# EAGLE design binary_watch (EAGLE 9.6.2)

## Sheet 1 of 2
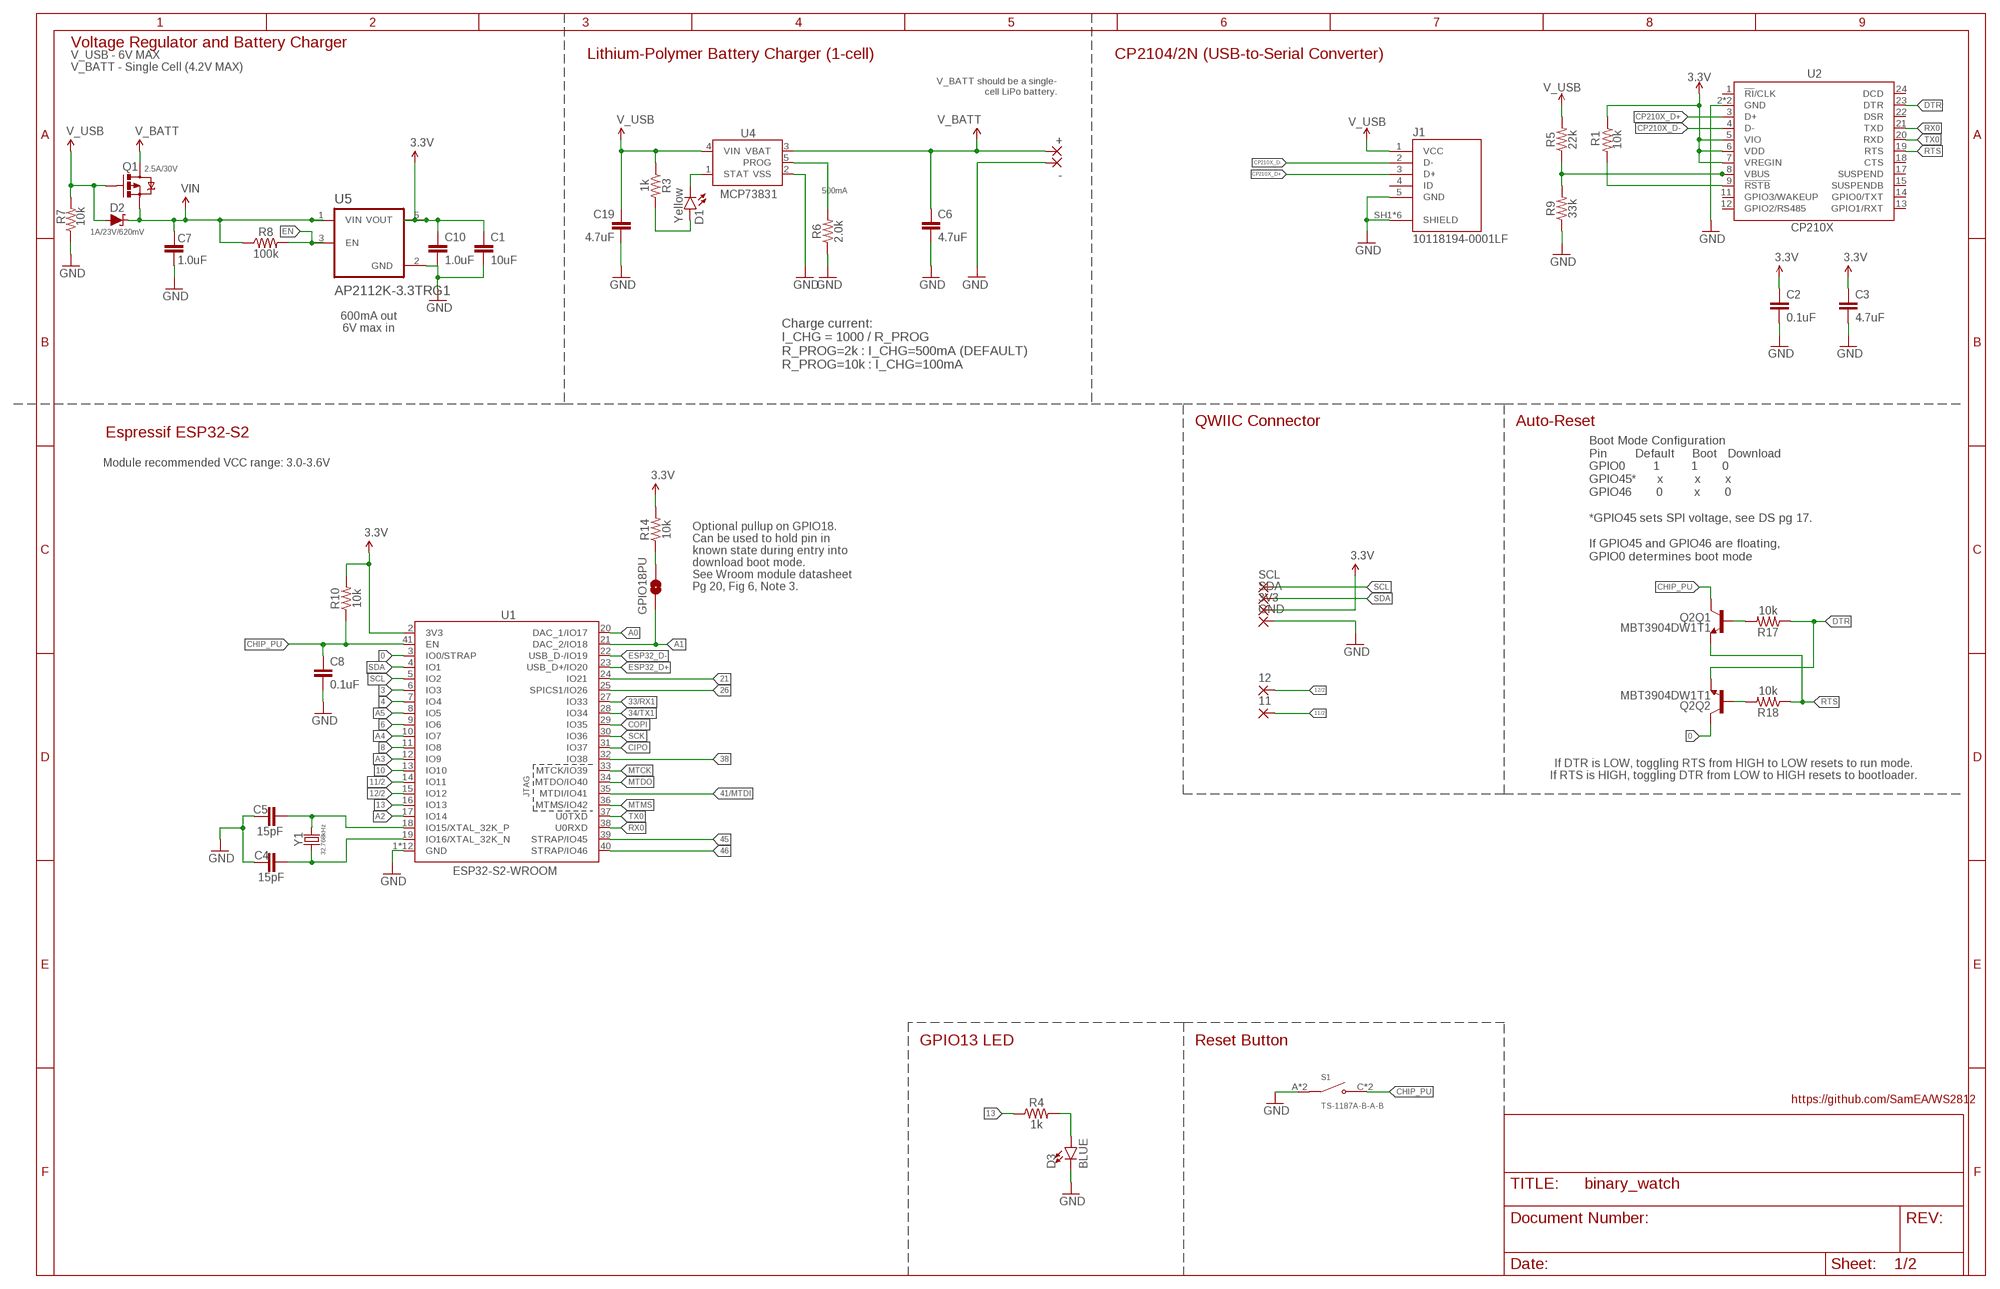
[diagram p0: schematic, sheet 1]

### Parts
3V3  1,6/0,8  [1,6/0,8]
11  1,6/0,8  [1,6/0,8]
12  1,6/0,8  [1,6/0,8]
+  WIREPAD1,6/0,8  [1,6/0,8]
-  WIREPAD1,6/0,8  [1,6/0,8]
C1  10uF  10UF-0402T-6.3V-20%  [0402-TIGHT]
C2  0.1uF  0.1UF-0402T-16V-10%  [0402-TIGHT]
C3  4.7uF  4.7UF-0402_TIGHT-6.3V-20%-X5R  [0402-TIGHT]
C4  15pF  15PF-0402T-50V-5%  [0402-TIGHT]
C5  15pF  15PF-0402T-50V-5%  [0402-TIGHT]
C6  4.7uF  4.7UF-0402_TIGHT-6.3V-20%-X5R  [0402-TIGHT]
C7  1.0uF  1.0UF-0402T-16V-10%  [0402-TIGHT]
C8  0.1uF  0.1UF-0402T-16V-10%  [0402-TIGHT]
C10  1.0uF  1.0UF-0402T-16V-10%  [0402-TIGHT]
C19  4.7uF  4.7UF-0402_TIGHT-6.3V-20%-X5R  [0402-TIGHT]
D1  Yellow  LED-YELLOW0603  [LED-0603]
D2  1A/23V/620mV  DIODE-SCHOTTKY-BAT20J  [SOD-323]
D3  BLUE  LED-BLUE0603  [LED-0603]
GND  1,6/0,8  [1,6/0,8]
GPIO18PU  JUMPER-SMT_2_NO_SILK  [SMT-JUMPER_2_NO_SILK]
J1  10118194-0001LF  [AMPHENOL_10118194-0001LF]
Q1  2.5A/30V  MOSFET-PCHANNELDMG2307L  [SOT23-3@1]
Q2  MBT3904DW1T1  TRANS_NPN_DUAL-MBT3904DW1T1  [SC70-6]
R1  10k  10KOHM-0402T-1/16W-1%  [0402-TIGHT]
R3  1k  1KOHM-0402T-1/16W-1%  [0402-TIGHT]
R4  1k  1KOHM-0402T-1/16W-1%  [0402-TIGHT]
R5  22k  22KOHM-0402_TIGHT-1/10W-1%  [0402-TIGHT]
R6  2.0k  2.0KOHM1/10W5%(0603)  [0603]
R7  10k  10KOHM-0402T-1/16W-1%  [0402-TIGHT]
R8  100k  100KOHM-0402T-1/16W-1%  [0402-TIGHT]
R9  33k  33KOHM-0402T-1/16W-1%  [0402-TIGHT]
R10  10k  10KOHM-0402T-1/16W-1%  [0402-TIGHT]
R14  10k  10KOHM-0402T-1/16W-1%  [0402-TIGHT]
R17  10k  10KOHM-0402T-1/16W-1%  [0402-TIGHT]
R18  10k  10KOHM-0402T-1/16W-1%  [0402-TIGHT]
S1  TS-1187A-B-A-B  [SW_TS-1187A-B-A-B]
SCL  1,6/0,8  [1,6/0,8]
SDA  1,6/0,8  [1,6/0,8]
U1  ESP32-S2-WROOM  [ESP32-S2-WROOM]
U2  CP210X  CP2102N  [QFN24]
U4  MCP73831  [SOT23-5]
U5  AP2112K-3.3TRG1  [SOT95P285X140-5N]
Y1  32.768kHz  CRYSTAL-32.768KHZSMD-3.2X1.5  [CRYSTAL-SMD-3.2X1.5MM]

### Nets
0: Q2.6(Q2:C) U1.3(IO0/STRAP)
3: U1.6(IO3)
3.3V: 3V3.1(P) C1.1 C2.1 C3.1 C10.1 R1.1 R10.2 R14.2 U1.2(3V3) U2.5(VIO) U2.6(VDD) U2.7(VREGIN) U5.5(VOUT) ; also sheet 2
4: U1.7(IO4)
6: U1.9(IO6)
8: U1.11(IO8)
10: U1.13(IO10)
11: 11.1(P) U1.14(IO11) ; also sheet 2
12: 12.1(P) U1.15(IO12) ; also sheet 2
13: R4.1 U1.16(IO13)
21: U1.24(IO21)
26: U1.25(SPICS1/IO26)
33/RX1: U1.27(IO33)
34/TX1: U1.28(IO34)
38: U1.32(IO38)
41/MTDI: U1.35(MTDI/IO41)
45: U1.39(STRAP/IO45)
46: U1.40(STRAP/IO46)
A0: U1.20(DAC_1/IO17)
A1: GPIO18PU.1 U1.21(DAC_2/IO18)
A2: U1.17(IO14)
A3: U1.12(IO9)
A4: U1.10(IO7)
A5: U1.8(IO5)
CHG: D1.C U4.1(STAT)
CHIP_PU: C8.1 Q2.3(Q1:C) R10.1 S1.C(NO) S1.D(NO) U1.41(EN)
CIPO: U1.31(IO37)
COPI: U1.29(IO35)
CP210X_D+: J1.3(D+) U2.3(D+)
CP210X_D-: J1.2(D-) U2.4(D-)
DTR: Q2.1(Q2:E) R17.1 U2.23(DTR)
EN: R8.2 U5.3(EN)
ESP32_D+: U1.23(USB_D+/IO20)
ESP32_D-: U1.22(USB_D-/IO19)
GND: -.1(P) C1.2 C2.2 C3.2 C4.1 C5.1 C6.2 C7.2 C8.2 C10.2 C19.2 D3.C GND.1(P) J1.5(GND) J1.SH1(SHIELD) J1.SH2(SHIELD) J1.SH3(SHIELD) J1.SH4(SHIELD) J1.SH5(SHIELD) J1.SH6(SHIELD) R6.1 R7.1 R9.1 S1.A(COM) S1.B(COM) U1.1(GND) U1.26(GND) U1.42(GND) U1.GNDEP0(GND) U1.GNDEP1(GND) U1.GNDEP2(GND) U1.GNDEP3(GND) U1.GNDEP4(GND) U1.GNDEP5(GND) U1.GNDEP6(GND) U1.GNDEP7(GND) U1.GNDEP8(GND) U2.2(GND) U2.PAD(GND) U4.2(VSS) U5.2(GND) ; also sheet 2
MTCK: U1.33(MTCK/IO39)
MTDO: U1.34(MTDO/IO40)
MTMS: U1.36(MTMS/IO42)
N$1: R1.2 U2.9(!RSTB)
N$2: D3.A R4.2
N$4: R5.1 R9.2 U2.8(VBUS)
N$7: C5.2 U1.18(IO15/XTAL_32K_P) Y1.P$2
N$8: C4.2 U1.19(IO16/XTAL_32K_N) Y1.P$1
N$9: R6.2 U4.5(PROG)
N$10: Q2.5(Q1:B) R17.2
N$12: Q2.2(Q2:B) R18.2
N$14: GPIO18PU.2 R14.1
N$17: D1.A R3.2
RTS: Q2.4(Q1:E) R18.1 U2.19(RTS)
RX0: U1.38(U0RXD) U2.21(TXD)
SCK: U1.30(IO36)
SCL: SCL.1(P) U1.5(IO2)
SDA: SDA.1(P) U1.4(IO1)
TX0: U1.37(U0TXD) U2.20(RXD)
V_BATT: +.1(P) C6.1 Q1.3(D) U4.3(VBAT)
V_USB: C19.1 D2.A J1.1(VCC) Q1.1(G) R3.1 R5.2 R7.2 U4.4(VIN)
VIN: C7.1 D2.C Q1.2(S) R8.1 U5.1(VIN)
Unconnected: J1.4(ID) U2.1(!RI!/CLK) U2.11(GPIO3/WAKEUP) U2.12(GPIO2/RS485) U2.13(GPIO1/RXT) U2.14(GPIO0/TXT) U2.15(SUSPENDB) U2.17(SUSPEND) U2.18(CTS) U2.22(DSR) U2.24(DCD)

### Notes on the sheet
- Voltage Regulator and Battery Charger
- Lithium-Polymer Battery Charger (1-cell) | CP2104/2N (USB-to-Serial Converter)
- V_USB - 6V MAX
  V_BATT - Single Cell (4.2V MAX)
- V_BATT should be a single-
  cell LiPo battery.
- 500mA
- 600mA out
  6V max in
- Charge current:
  I_CHG = 1000 / R_PROG
  R_PROG=2k : I_CHG=500mA (DEFAULT)
  R_PROG=10k : I_CHG=100mA
- QWIIC Connector | Auto-Reset
- Espressif ESP32-S2
- Module recommended VCC range: 3.0-3.6V
- Boot Mode Configuration
  Pin        Default     Boot   Download
  GPIO0        1         1       0
  GPIO45*      x         x       x 
  GPIO46       0         x       0
  
  *GPIO45 sets SPI voltage, see DS pg 17.
  
  If GPIO45 and GPIO46 are floating, 
  GPIO0 determines boot mode
- Optional pullup on GPIO18.
  Can be used to hold pin in 
  known state during entry into
  download boot mode. 
  See Wroom module datasheet
  Pg 20, Fig 6, Note 3.
- If DTR is LOW, toggling RTS from HIGH to LOW resets to run mode.
  If RTS is HIGH, toggling DTR from LOW to HIGH resets to bootloader.
- GPIO13 LED | Reset Button
- https://github.com/SamEA/WS2812

## Sheet 2 of 2
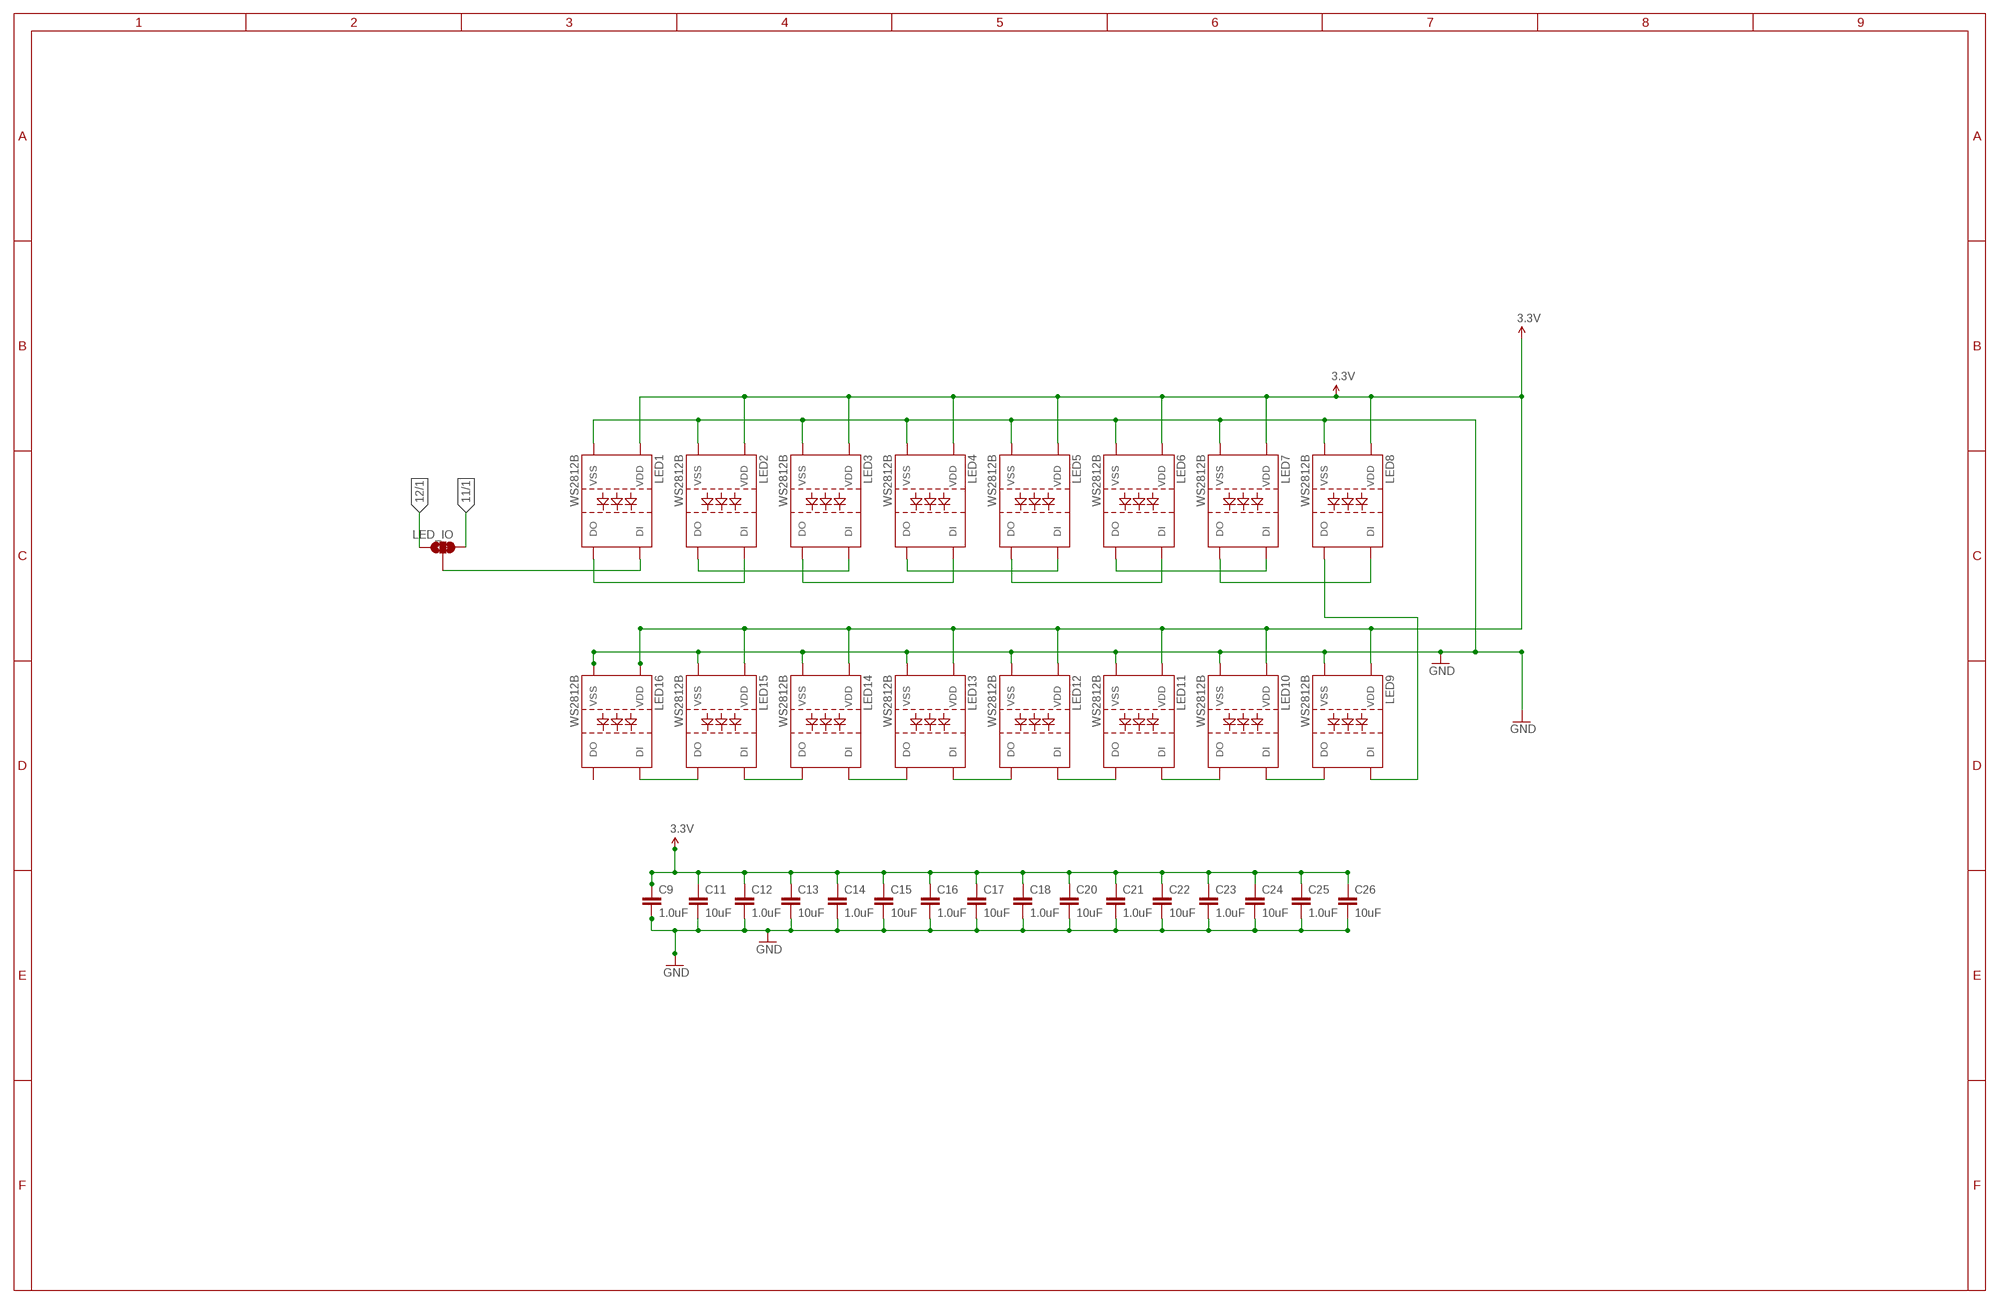
[diagram p1: schematic, sheet 2]

### Parts
C9  1.0uF  1.0UF-0402T-16V-10%  [0402-TIGHT]
C11  10uF  10UF-0402T-6.3V-20%  [0402-TIGHT]
C12  1.0uF  1.0UF-0402T-16V-10%  [0402-TIGHT]
C13  10uF  10UF-0402T-6.3V-20%  [0402-TIGHT]
C14  1.0uF  1.0UF-0402T-16V-10%  [0402-TIGHT]
C15  10uF  10UF-0402T-6.3V-20%  [0402-TIGHT]
C16  1.0uF  1.0UF-0402T-16V-10%  [0402-TIGHT]
C17  10uF  10UF-0402T-6.3V-20%  [0402-TIGHT]
C18  1.0uF  1.0UF-0402T-16V-10%  [0402-TIGHT]
C20  10uF  10UF-0402T-6.3V-20%  [0402-TIGHT]
C21  1.0uF  1.0UF-0402T-16V-10%  [0402-TIGHT]
C22  10uF  10UF-0402T-6.3V-20%  [0402-TIGHT]
C23  1.0uF  1.0UF-0402T-16V-10%  [0402-TIGHT]
C24  10uF  10UF-0402T-6.3V-20%  [0402-TIGHT]
C25  1.0uF  1.0UF-0402T-16V-10%  [0402-TIGHT]
C26  10uF  10UF-0402T-6.3V-20%  [0402-TIGHT]
LED1  WS2812B  [WS2812B]
LED2  WS2812B  [WS2812B]
LED3  WS2812B  [WS2812B]
LED4  WS2812B  [WS2812B]
LED5  WS2812B  [WS2812B]
LED6  WS2812B  [WS2812B]
LED7  WS2812B  [WS2812B]
LED8  WS2812B  [WS2812B]
LED9  WS2812B  [WS2812B]
LED10  WS2812B  [WS2812B]
LED11  WS2812B  [WS2812B]
LED12  WS2812B  [WS2812B]
LED13  WS2812B  [WS2812B]
LED14  WS2812B  [WS2812B]
LED15  WS2812B  [WS2812B]
LED16  WS2812B  [WS2812B]
LED_IO  JUMPER-SMT_3_1-NC_TRACE_SILK  [SMT-JUMPER_3_1-NC_TRACE_SILK]

### Nets
3.3V: C9.1 C11.1 C12.1 C13.1 C14.1 C15.1 C16.1 C17.1 C18.1 C20.1 C21.1 C22.1 C23.1 C24.1 C25.1 C26.1 LED1.1(VDD) LED2.1(VDD) LED3.1(VDD) LED4.1(VDD) LED5.1(VDD) LED6.1(VDD) LED7.1(VDD) LED8.1(VDD) LED9.1(VDD) LED10.1(VDD) LED11.1(VDD) LED12.1(VDD) LED13.1(VDD) LED14.1(VDD) LED15.1(VDD) LED16.1(VDD) ; also sheet 1
11: LED_IO.3 ; also sheet 1
12: LED_IO.1 ; also sheet 1
GND: C9.2 C11.2 C12.2 C13.2 C14.2 C15.2 C16.2 C17.2 C18.2 C20.2 C21.2 C22.2 C23.2 C24.2 C25.2 C26.2 LED1.3(VSS) LED2.3(VSS) LED3.3(VSS) LED4.3(VSS) LED5.3(VSS) LED6.3(VSS) LED7.3(VSS) LED8.3(VSS) LED9.3(VSS) LED10.3(VSS) LED11.3(VSS) LED12.3(VSS) LED13.3(VSS) LED14.3(VSS) LED15.3(VSS) LED16.3(VSS) ; also sheet 1
N$15: LED1.4(DI) LED_IO.2
N$16: LED1.2(DO) LED2.4(DI)
N$18: LED2.2(DO) LED3.4(DI)
N$19: LED3.2(DO) LED4.4(DI)
N$20: LED4.2(DO) LED5.4(DI)
N$21: LED5.2(DO) LED6.4(DI)
N$22: LED6.2(DO) LED7.4(DI)
N$23: LED7.2(DO) LED8.4(DI)
N$26: LED8.2(DO) LED9.4(DI)
N$27: LED9.2(DO) LED10.4(DI)
N$28: LED10.2(DO) LED11.4(DI)
N$29: LED11.2(DO) LED12.4(DI)
N$30: LED12.2(DO) LED13.4(DI)
N$31: LED13.2(DO) LED14.4(DI)
N$32: LED14.2(DO) LED15.4(DI)
N$33: LED15.2(DO) LED16.4(DI)
Unconnected: LED16.2(DO)

## Library data of the parts
3V3 11 12 GND SCL SDA = wirepad:1,6/0,8: THROUGH-HOLE PAD
+ - = wirepad:WIREPAD: Wire PAD connect wire on PCB
C1 C11 C13 C15 C17 C20 C22 C24 C26 = SparkFun-Capacitors:10UF: 10.0µF ceramic capacitors A capacitor is a passive two-terminal electrical component used to store electrical energy temporarily in an electric field.; PROD_ID: CAP-14848
C2 C8 = SparkFun-Capacitors:0.1UF: 0.1µF ceramic capacitors A capacitor is a passive two-terminal electrical component used to store electrical energy temporarily in an electric field.; PROD_ID: CAP-12416
C3 C6 C19 = SparkFun-Capacitors:4.7UF: 4.7µF ceramic capacitors A capacitor is a passive two-terminal electrical component used to store electrical energy temporarily in an electric field.; PROD_ID: CAP-14240
C4 C5 = SparkFun-Capacitors:15PF: 15pF ceramic capacitors A capacitor is a passive two-terminal electrical component used to store electrical energy temporarily in an electric field.; PROD_ID: CAP-13063
C7 C9 C10 C12 C14 C16 C18 C21 C23 C25 = SparkFun-Capacitors:1.0UF: 1µF ceramic capacitors A capacitor is a passive two-terminal electrical component used to store electrical energy temporarily in an electric field.; PROD_ID: CAP-12417
D1 = SparkFun-LED:LED-YELLOW: Yellow SMD LED Used in manufacturing several products at SparkFun. Packages: 0603 - SMD 0603 package[Product Link] <http://www.kingbrightusa.com/product.asp?catalog_name=LED&product_id=APT1608SYCK> 0603 -SMART - SMART SMD 0603 package (more efficient/more expensive) [Product Link] <http://www.osram-os.com/osram_os/en/products/product-catalog/led-light-emitting-diodes/smartled-0603/ly-l29k/index.jsp> LilyPad - SMD1206 package[Product Datasheet] <https://www.sparkfun.com/datasheets/DevTools/LilyPad/Q150YUS4.pdf> SparkFun Products: Blynk Board <https://www.sparkfun.com/products/13794> IOIO-OTG <https://www.sparkfun.com/products/13613> XBee Explorer Serial <https://www.sparkfun.com/products/13225>; PROD_ID: DIO-09003
D2 = SparkFun-DiscreteSemi:DIODE-SCHOTTKY: Schottky diode A Schottky diode is a semiconductor diode which has a low forward voltage drop and a very fast switching action.; PROD_ID: DIO-11623
D3 = SparkFun-LED:LED-BLUE: Blue SMD LED Used in manufacturing of various products at SparkFun Packages: 0603 - SMD 0603 package [Product Link] <http://www.digikey.com/product-detail/en/SMLE12BC7TT86/511-1589-2-ND/1641808> 1206 - SMD1206 package [Product Link] <http://www.digikey.com/product-detail/en/lite-on-inc/LTST-C150TBKT/160-1643-1-ND/573584> SparkFun Products: ESP8266 Thing-Dev Board <https://www.sparkfun.com/products/13711> RedBoard <https://www.sparkfun.com/products/12757>; PROD_ID: DIO-08575
GPIO18PU = SparkFun-Jumpers:JUMPER-SMT_2_NO: Normally open jumper This jumper has two pads in close proximity to each other. Apply solder to close the connection. Round pads are easier to solder for beginners, but are a lot larger. SparkFun Product that uses the round pads: SparkFun EL Sequencer <https://www.sparkfun.com/products/12781>
J1 = 10118194-0001LF:10118194-0001LF: Check availability <https://pricing.snapeda.com/parts/10118194-0001LF/Amphenol%20ICC/view-part?ref=eda>; AVAILABILITY: In Stock; CHECK_PRICES: https://www.snapeda.com/parts/10118194-0001LF/Amphenol+FCI/view-part/?ref=eda; DESCRIPTION: Micro USB, Input Output Connectors, B TYPE RECEPTACLE with flange; MF: Amphenol ICC; MP: 10118194-0001LF; PACKAGE: None; PRICE: None; PURCHASE-URL: https://www.snapeda.com/api/url_track_click_mouser/?unipart_id=47625&manufacturer=Amphenol ICC&part_name=10118194-0001LF&search_term=usb micro; SNAPEDA_LINK: https://www.snapeda.com/parts/10118194-0001LF/Amphenol+FCI/view-part/?ref=snap
LED1-LED16 = WS2812:WS2812B
LED_IO = SparkFun-Jumpers:JUMPER-SMT_3_1-NC_TRACE: Normally closed trace jumper (1 of 2 connections) This jumper has a trace between two pads so it's normally closed (NC). The other connection is normally open (NO). Use a razor knife to open the connection. For best results follow the IPC guidelines for cutting traces: Cutout at least 0.063 mm (0.005 in). Remove all loose material to clean up the cut area. Seal the cut with an approved epoxy. Reapply solder to reclose the connection, or to close the NO connection.
Q1 = SparkFun-DiscreteSemi:MOSFET-PCHANNEL: Generic PMOSFET IRLML2244 - TRANS-11153 (SOT-23 -20V -4.3A) (1.Gate 2.Source 3.Drain) FQP27P06 - COM-10349 <http://www.sparkfun.com/products/10349> (TO-220 -60V -27A) (1.Gate 2.Source 3.Drain); PROD_ID: TRANS-11308
Q2 = SparkFun-DiscreteSemi:TRANS_NPN_DUAL: Dual NPN Transistors in Single Package The MBT3904W1 puts two general purpose 3904 NPN transistors in a single package. Datasheet <http://www.onsemi.com/pub_link/Collateral/MBT3904DW1T1-D.PDF> SparkFun Products: SparkFun ESP32 Thing <https://www.sparkfun.com/products/13907>; PROD_ID: TRANS-13337
R1 R7 R10 R14 R17 R18 = SparkFun-Resistors:10KOHM: 10kΩ resistor A resistor is a passive two-terminal electrical component that implements electrical resistance as a circuit element. Resistors act to reduce current flow, and, at the same time, act to lower voltage levels within circuits. - Wikipedia; PROD_ID: RES-14241
R3 R4 = SparkFun-Resistors:1KOHM: 1kΩ resistor A resistor is a passive two-terminal electrical component that implements electrical resistance as a circuit element. Resistors act to reduce current flow, and, at the same time, act to lower voltage levels within circuits. - Wikipedia; PROD_ID: RES-14342
R5 = SparkFun-Resistors:22KOHM: 22kΩ resistor A resistor is a passive two-terminal electrical component that implements electrical resistance as a circuit element. Resistors act to reduce current flow, and, at the same time, act to lower voltage levels within circuits. - Wikipedia; PROD_ID: RES-14281
R6 = SparkFun-Resistors:2.0KOHM1/10W5%(0603): RES-08296; PROD_ID: RES-08296
R8 = SparkFun-Resistors:100KOHM: 100kΩ resistor A resistor is a passive two-terminal electrical component that implements electrical resistance as a circuit element. Resistors act to reduce current flow, and, at the same time, act to lower voltage levels within circuits. - Wikipedia; PROD_ID: RES-13495
R9 = SparkFun-Resistors:33KOHM: 33kΩ resistor A resistor is a passive two-terminal electrical component that implements electrical resistance as a circuit element. Resistors act to reduce current flow, and, at the same time, act to lower voltage levels within circuits. - Wikipedia; PROD_ID: RES-15128
S1 = TS-1187A-B-A-B footprint:TS-1187A-B-A-B: SPST 50mA @ 12VDC Top Actuated Round Button 160gf SMD Tactile Switches RoHS Check availability <https://pricing.snapeda.com/parts/TS-1187A-B-A-B/XKB%20Industrial%20Precision/view-part?ref=eda>; AVAILABILITY: Not in stock; CHECK_PRICES: https://www.snapeda.com/parts/TS-1187A-B-A-B/XKB+Industrial+Precision/view-part/?ref=eda; DESCRIPTION: TS-1187A-B-A-B XKB Connectivity; MF: XKB Industrial Precision; MP: TS-1187A-B-A-B; PACKAGE: Package; PRICE: None; SNAPEDA_LINK: https://www.snapeda.com/parts/TS-1187A-B-A-B/XKB+Industrial+Precision/view-part/?ref=snap
U1 = esp32-s2-wroom:ESP32-S2-WROOM: ESP32-S2-WROOM - trace antenna (includes keepout); PROD_ID: IC-15599
U2 = SparkFun-IC-Comms:CP2102N; PROD_ID: IC-14020
U4 = SparkFun-PowerIC:MCP73831: Miniature single cell, fully integrated Li-Ion, Li-polymer charge management controller http://ww1.microchip.com/downloads/en/DeviceDoc/20001984g.pdf IC-09995; PROD_ID: IC-09995
U5 = AP2112K-3.3TRG1 footprint:AP2112K-3.3TRG1: AP2112 Series 0.6 A 3.3 V Fixed Output SMT LDO Linear Regulator - SOT23-5 Check availability <https://pricing.snapeda.com/parts/AP2112K-3.3TRG1/Diodes%20Inc./view-part?ref=eda>; AVAILABILITY: In Stock; CHECK_PRICES: https://www.snapeda.com/parts/AP2112K-3.3TRG1/Diodes+Inc./view-part/?ref=eda; DESCRIPTION: Voltage Regulators, LDO, 600mA CMOS LDO 50mA 3.3V 250mV | Diodes Inc AP2112K-3.3TRG1; MF: Diodes Inc.; MP: AP2112K-3.3TRG1; PACKAGE: SOT-753 Diodes Inc.; PRICE: None; PURCHASE-URL: https://www.snapeda.com/api/url_track_click_mouser/?unipart_id=454988&manufacturer=Diodes Inc.&part_name=AP2112K-3.3TRG1&search_term=ap2112k-3.3trg1; SNAPEDA_LINK: https://www.snapeda.com/parts/AP2112K-3.3TRG1/Diodes+Inc./view-part/?ref=snap
Y1 = SparkFun-Clocks:CRYSTAL-32.768KHZ: 32.768kHz Crystal Frequency: 32.768kHz Frequency Stability: ±20ppm Load Capacitance: 12.5pF (PTH-2X6 & SMD-3.2X1.5), 6pF (SMD-2X6) SparkFun Products: SparkFun BigTime Watch Kit <https://www.sparkfun.com/products/11734> SparkFun nRF52832 Breakout <https://www.sparkfun.com/products/13990> SparkFun Real Time Clock Module <https://www.sparkfun.com/products/12708>; PROD_ID: XTAL-13062

## Board
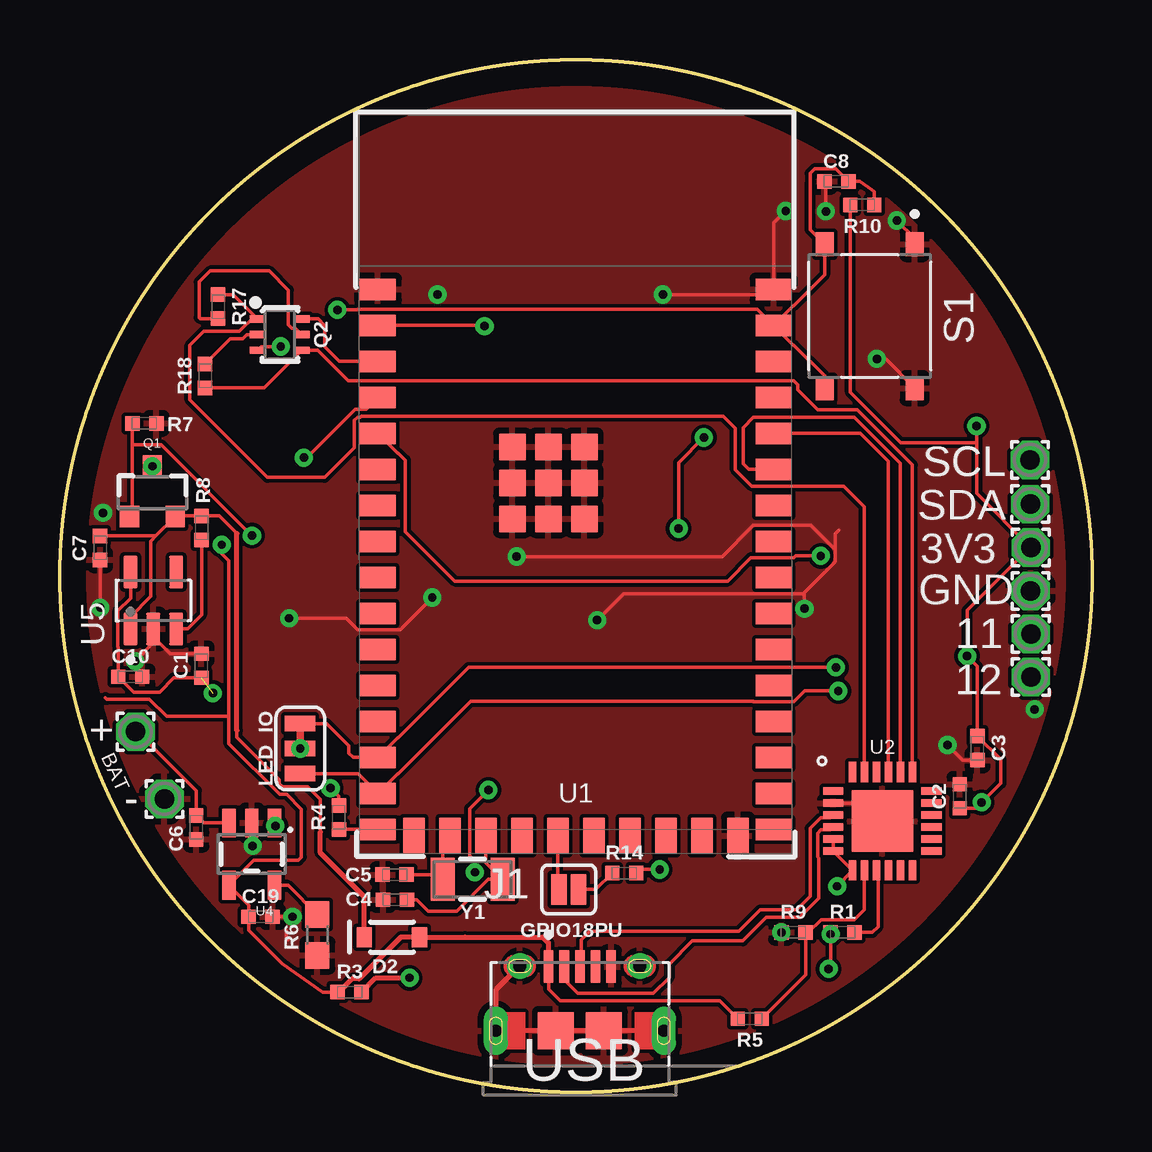
[diagram p2: board, top side]
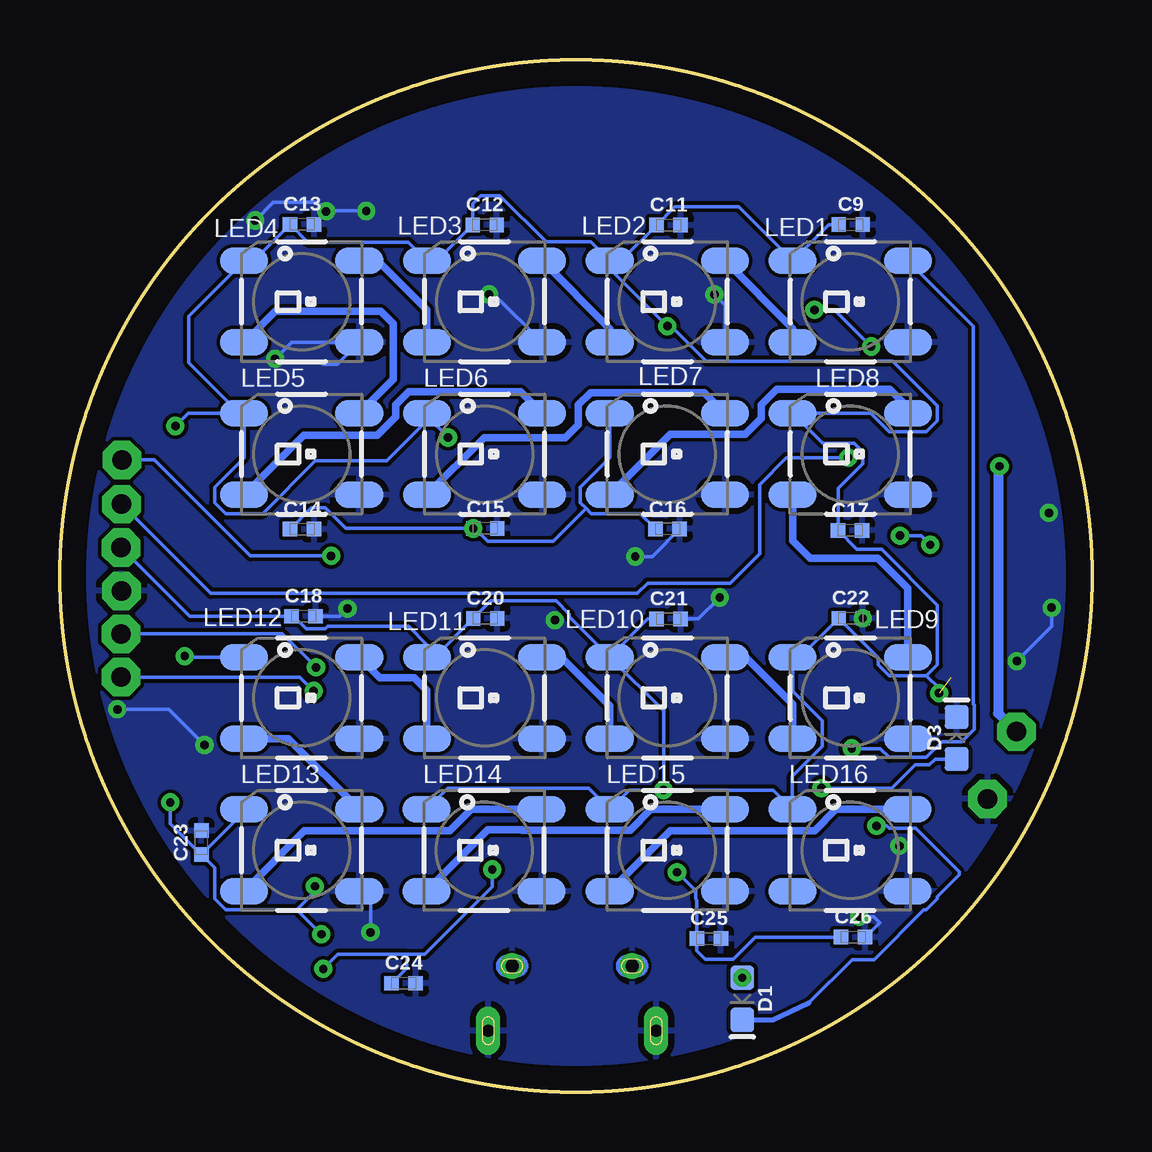
[diagram p3: board, bottom side, seen from below]

Size 43 x 43 mm. Coordinates in mm from the lower left corner, seen from the top.
Outline: circle at 21.5,21.5 radius 21.5
Copper layers (1*16): Top 0.035mm / dielectric 1.5mm / Bottom 0.035mm
Design rules "default": minimum track width 6mil, minimum drill 0.35mm, track to track 6mil, track to pad 6mil, pad to pad 6mil, via to via 6mil, smd to smd 6mil, copper to edge 40mil, drill to drill 6mil, minimum pad ring 10mil, minimum via ring 8mil, stop-mask expansion 4mil, vias tented up to drill 0mil, thermal gap 10mil

### Footprints (pad centres in the part's own frame; a part is rotated, then mirrored left to right if it is on the bottom)
1,6/0,8 = drill 0.813 pad 1.6 octagon: 1 0,0
0402-TIGHT = smd 0.6 x 0.6: 1 -0.5,0; 2 0.5,0
LED-0603 = smd 1 x 1: A -0.877,0; C 0.877,0
SOD-323 = smd 0.63 x 0.83: A 1.15,0; C -1.15,0
SMT-JUMPER_2_NO_SILK = smd 0.635 x 1.27: 1 -0.406,0; 2 0.406,0
AMPHENOL_10118194-0001LF = smd 0.4 x 1.35: 1 -1.3,2.675; 2 -0.65,2.675; 3 0,2.675; 4 0.65,2.675; 5 1.3,2.675 | drill 0.5 pad 0.775 long: SH1 -3.5,0; SH4 3.5,0 | smd 1.5 x 1.55: SH2 1,0; SH3 -1,0 | drill 0.55 pad 0.95: SH5 -2.5,2.7; SH6 2.5,2.7
WS2812B = smd 2 x 1.1: 1 -2.4,1.7; 2 -2.4,-1.7; 3 2.4,-1.7; 4 2.4,1.7
SMT-JUMPER_3_1-NC_TRACE_SILK = smd 0.66 x 1.27: 1 -1.041,0; 2 0,0; 3 1.041,0
SOT23-3@1 = smd 0.8 x 0.9: 1 -0.95,-1; 2 0.95,-1; 3 0,1.1
SC70-6 = smd 0.3 x 0.66: 1 -0.65,-0.92; 2 0,-0.92; 3 0.65,-0.92; 4 0.65,0.92; 5 0,0.92; 6 -0.65,0.92
0603 = smd 1.1 x 1: 1 -0.85,0; 2 0.85,0
SW_TS-1187A-B-A-B = smd 1 x 0.75: A -3,1.875; B 3,1.875; C -3,-1.875; D 3,-1.875
ESP32-S2-WROOM = smd 0.9 x 1.5: 1 11.94,8.25; 2 10.44,8.25; 3 8.94,8.25; 4 7.44,8.25; 5 5.94,8.25; 6 4.44,8.25; 7 2.94,8.25; 8 1.44,8.25; 9 -0.06,8.25; 10 -1.56,8.25; 11 -3.06,8.25; 12 -4.56,8.25; 13 -6.06,8.25; 14 -7.56,8.25; 15 -9.06,8.25; 16 -10.56,8.25; 27 -10.56,-8.24; 28 -9.06,-8.24; 29 -7.56,-8.24; 30 -6.06,-8.24; 31 -4.56,-8.24; 32 -3.06,-8.24; 33 -1.56,-8.24; 34 -0.06,-8.24; 35 1.44,-8.24; 36 2.94,-8.24; 37 4.44,-8.24; 38 5.94,-8.24; 39 7.44,-8.24; 40 8.94,-8.24; 41 10.44,-8.24; 42 11.94,-8.24 | smd 1.5 x 0.9: 17 -10.82,6.75; 18 -10.82,5.25; 19 -10.82,3.75; 20 -10.82,2.25; 21 -10.82,0.75; 22 -10.82,-0.75; 23 -10.82,-2.25; 24 -10.82,-3.75; 25 -10.82,-5.25; 26 -10.82,-6.75 | smd 1.1 x 1.1: GNDEP0 3.88,1.15; GNDEP1 5.38,-0.35; GNDEP2 5.38,1.15; GNDEP3 5.38,2.65; GNDEP4 3.88,2.65; GNDEP5 2.38,2.65; GNDEP6 2.38,1.15; GNDEP7 2.38,-0.35; GNDEP8 3.88,-0.35
QFN24 = smd 0.85 x 0.3: 1 -2.05,1.25; 2 -2.05,0.75; 3 -2.05,0.25; 4 -2.05,-0.25; 5 -2.05,-0.75; 6 -2.05,-1.25; 13 2.05,-1.25; 14 2.05,-0.75; 15 2.05,-0.25; 16 2.05,0.25; 17 2.05,0.75; 18 2.05,1.25 | smd 0.3 x 0.85: 7 -1.25,-2.05; 8 -0.75,-2.05; 9 -0.25,-2.05; 10 0.25,-2.05; 11 0.75,-2.05; 12 1.25,-2.05; 19 1.25,2.05; 20 0.75,2.05; 21 0.25,2.05; 22 -0.25,2.05; 23 -0.75,2.05; 24 -1.25,2.05 | smd 2.55 x 2.55: PAD 0,0
SOT23-5 = smd 0.55 x 1.2: 1 -0.95,-1.3; 2 0,-1.3; 3 0.95,-1.3; 4 0.95,1.3; 5 -0.95,1.3
SOT95P285X140-5N = smd 1.35 x 0.6: 1 -1.185,0.95; 2 -1.185,0; 3 -1.185,-0.95; 4 1.185,-0.95; 5 1.185,0.95
CRYSTAL-SMD-3.2X1.5MM = smd 1 x 1.8: P$1 -1.25,0; P$2 1.25,0

### Placement (x,y rotation side)
3V3  40.45,22.68 0 top
11  40.45,19.09 0 top
12  40.45,17.29 0 top
+  3.15,15.01 0 top
-  4.35,12.21 0 top
C1  5.89,17.76 90 top
C2  37.49,12.32 90 top
C3  38.23,14.33 270 top
C4  13.96,8.01 0 top
C5  13.94,9.06 0 top
C6  5.68,11.02 270 top
C7  1.67,22.67 270 top
C8  32.35,37.94 180 top
C9  10.05,36.14 0 bottom
C10  2.93,17.3 0 top
C11  17.64,36.12 0 bottom
C12  25.3,36.13 0 bottom
C13  32.91,36.15 0 bottom
C14  32.91,23.45 0 bottom
C15  25.28,23.48 0 bottom
C16  17.68,23.46 0 bottom
C17  10.08,23.4 0 bottom
C18  32.85,19.82 0 bottom
C19  8.36,7.3 0 top
C20  25.28,19.73 0 bottom
C21  17.64,19.71 0 bottom
C22  10.05,19.74 0 bottom
C23  37.11,10.39 90 bottom
C24  28.68,4.53 0 bottom
C25  15.96,6.39 0 bottom
C26  9.95,6.45 0 bottom
D1  14.57,3.88 270 bottom
D2  13.83,6.45 0 top
D3  5.64,14.75 90 bottom
GND  40.44,20.88 0 top
GPIO18PU  21.2,8.44 0 top
J1  21.66,2.55 0 top
LED1  10.07,32.93 0 bottom
LED2  17.69,32.93 0 bottom
LED3  25.31,32.93 0 bottom
LED4  32.93,32.93 0 bottom
LED5  32.93,26.58 0 bottom
LED6  25.31,26.58 0 bottom
LED7  17.69,26.58 0 bottom
LED8  10.07,26.58 0 bottom
LED9  10.07,16.42 0 bottom
LED10  17.69,16.42 0 bottom
LED11  25.31,16.42 0 bottom
LED12  32.93,16.42 0 bottom
LED13  32.93,10.07 0 bottom
LED14  25.33,10.07 0 bottom
LED15  17.69,10.07 0 bottom
LED16  10.08,10.07 0 bottom
LED_IO  10.01,14.31 90 top
Q1  3.85,24.97 0 top
Q2  9.16,31.56 270 top
R1  32.61,6.65 0 top
R3  12.07,4.16 0 top
R4  11.62,11.44 90 top
R5  28.74,3.05 180 top
R6  10.73,6.54 90 top
R7  3.52,27.86 180 top
R8  5.9,23.5 270 top
R9  30.56,6.65 0 top
R10  33.43,36.96 180 top
R14  23.51,9.12 0 top
R17  6.59,32.72 270 top
R18  6.05,29.84 90 top
S1  33.74,32.33 270 top
SCL  40.42,26.34 0 top
SDA  40.43,24.49 0 top
U1  21.5,21.5 90 top
U2  34.27,11.29 0 top
U4  7.99,9.91 180 top
U5  3.89,20.48 90 top
Y1  17.19,8.86 180 top

### Tracks (layer width: path | path; a pad name or v marks a point on that pad's centre or on a via)
0
  Top 0.152: U1.3 11.64,30.44 11.04,31.04 11.04,31.93 10.76,32.21 Q2.6
3.3V  (via drill 0.35)  (1 unrouted)
  Top 0.152: v32.03,5.13 32.11,5.21 v32.11,6.57 R1.1 | C2.1 38.16,11.82 v38.4,12.06 39.2,12.86 39.2,13.86 C3.1 38.23,17.73 v37.8,18.16 37.8,20.07 40.41,22.68 3V3.1 38.19,24.94 38.19,27.05 | U2.5 U2.6 U2.7 33.02,9.21 v32.38,8.57 | U1.2 17.66,31.94 v17.69,31.91 | v38.19,27.75 38.19,27.05 | v17.29,9.15 17.29,9.62 17.07,9.83 17.07,11.8 v17.85,12.58 | v26.83,27.27 25.78,26.22 C15.1 | R14.2 24.16,9.27 v24.99,9.27 | 38.19,27.05 35.03,27.05 32.93,29.15 R10.2 | U5.5 2.94,20.58 2.41,20.05 2.41,18.55 2.43,18.53 C10.1 3.06,16.66 4.15,16.66 4.75,17.26 C1.1
  Bottom 0.152: C24.1 28.55,5.16 28.55,5.73 | 28.55,5.73 31.43,5.73 v32.03,5.13 | 6.9,17.34 8.44,17.34 8.9,17.8 8.9,18.09 C22.1 12.17,18.12 LED9.1 12.47,16.7 11.24,15.47 11.24,14.4 12.48,13.16 LED16.1 13.29,12.58 v17.85,12.58 | 6.9,17.34 6.44,17.8 6.44,20.29 8.76,22.61 9.79,22.61 C17.1 10.58,25.15 9.55,26.18 9.55,26.68 9.91,27.04 11.23,27.04 LED8.1 9.22,28.28 8.44,27.5 6.9,27.5 6.44,27.96 6.44,28.6 8.29,30.45 16.06,30.45 17.52,31.91 v17.69,31.91 20.09,34.31 LED2.1 | 6.9,17.34 6.37,16.81 v6.37,16.62 | LED10.1 18.5,19.71 C21.1 | 21.08,24.32 21.32,24.56 21.32,25.2 20.09,26.43 LED7.1 | 21.08,24.32 20.86,24.1 18.82,24.1 C16.1 | C9.1 10.96,36.14 LED1.1 14.72,36.88 17.38,36.88 C11.1 19.63,34.63 LED2.1 | LED5.1 35.52,28.28 37.63,30.39 37.63,32.33 LED4.1 34.93,34.63 C13.1 32.67,35.41 28.49,35.41 LED3.1 27.3,34.63 C12.1 25.8,37.01 25.46,37.35 24.67,37.35 22.74,35.42 20.88,35.42 LED2.1 | 21.08,24.32 22.45,22.95 25.17,22.95 25.7,23.48 C15.1 31.09,23.48 31.95,24.34 32.52,24.34 C14.1 | 3V3.1 37.59,19.82 C18.1 33.27,19.82 32.74,19.29 31.95,19.29 31.85,19.4 28.47,19.4 27.71,18.64 LED11.1 27.39,18.12 C20.1 25.04,20.46 22.33,20.46 21.77,19.91 21.77,19.8 LED10.1 | C23.1 35.33,11.67 LED13.1 | v32.11,6.57 33.13,7.59 | 33.13,7.59 36.1,7.59 36.56,8.05 36.56,9.34 C23.1 | v32.38,8.57 32.38,8.34 33.13,7.59 | LED12.1 37.76,18.12 v37.8,18.16 | LED5.1 37.66,28.28 v38.19,27.75 | C26.1 14.03,6.45 14.95,5.53 16.11,5.53 16.46,5.88 C25.1 16.46,7.99 16.52,8.05 16.52,8.38 v17.29,9.15 | C23.1 38.4,11.18 v38.4,12.06 | LED5.1 35.33,26.43 36.56,25.2 36.56,24.56 36.1,24.1 34.56,24.1 32.36,26.3 29.38,26.3 27.71,27.97 LED6.1 27.71,28.15 v26.83,27.27
  Bottom 0.152: 28.55,5.73 27.8,5.73 24.99,8.54 v24.99,9.27 | LED14.1 26.85,12.65 20.97,12.65 LED15.1 19.28,12.58 v17.85,12.58 | LED10.1 17.85,15.88 v17.85,12.58
  other vias: 25.78,23.48
11  (via drill 0.35)
  Top 0.152: LED_IO.3 11.11,15.35 12.04,14.42 12.04,14.11 12.21,13.94 U1.14 14.07,14.76 14.09,14.76 17.02,17.69 v32.33,17.69
  Bottom 0.152: v32.33,17.69 33.73,19.09 11.1
12  (via drill 0.35)
  Top 0.152: LED_IO.1 12.4,13.27 12.4,13.26 12.43,13.26 U1.15 14.07,13.26 14.09,13.26 17.11,16.28 28.88,16.28 28.89,16.26 30.58,16.26 31.03,16.71 v32.43,16.71
  Bottom 0.152: 12.1 33.01,17.29 v32.43,16.71
13
  Top 0.152: R4.1 U1.16
A1
  Top 0.152: GPIO18PU.1 20.75,8.48 U1.21
CHG  (via drill 0.35)
  Top 0.152: U4.1 8.97,11.17 v8.97,11.09
  Bottom 0.152: v8.97,11.09 8.55,11.09 8.45,10.99 8.01,10.99 7.34,10.99 5.53,9.18 5.53,9.06 6.45,8.14 6.45,8.05 6.91,7.59 7,7.59 9.08,5.51 9.99,5.51 11.79,3.71
  Bottom 0.2: D1.C 13.3,3 11.79,3.71
CHIP_PU  (via drill 0.35)
  Top 0.152: Q2.3 8.39,31.06 v9.2,31.06 | v11.56,32.59 12.38,32.59 12.4,32.62 29.06,32.62 U1.41 | S1.D 31.86,29.84 30.58,31.12 30.56,31.12 U1.41 | U1.41 30.56,32.76 30.58,32.76 31.86,34.04 S1.C 31.26,35.93 31.26,37.12 31.26,37.85 31.26,38.27 31.45,38.47 32.32,38.47 C8.1 33.33,37.94 33.83,37.59 33.9,37.54 33.93,37.51 R10.1
  Bottom 0.152: v9.2,31.06 10.73,32.59 v11.56,32.59
CP210X_D+
  Top 0.152: U2.3 32.1,11.42 31.7,11.42 31.26,10.98 31.26,8.15 30.69,7.58 29.17,7.58 28.27,6.69 22.07,6.69 21.72,6.34 21.72,5.28
  Top 0.203: 21.72,5.28 J1.3
CP210X_D-
  Top 0.152: U2.4 32.1,10.92 31.7,10.92 31.56,10.78 31.56,9.79 31.62,9.74 31.62,8.08 30.82,7.28 29.43,7.28 28.45,6.3 26.35,6.3 25.38,5.33 25.38,4.76 24.72,4.1 21.58,4.1 21.01,4.68 J1.2
DTR
  Top 0.152: R17.1 7.23,33.22 8.12,32.33 | 8.12,32.33 Q2.1 | U2.23 33.52,24.38 32.66,25.24 28.83,25.24 28.14,25.93 28.14,27.65 27.64,28.15 12.55,28.15 12.52,28.12 12.4,28.12 12.27,27.98 12.27,26.85 11.03,25.61 8.64,25.61 6.1,28.15 5.45,28.8 5.41,28.84 5.41,31.11 5.99,31.69 7.48,31.69 8.12,32.33
EN
  Top 0.152: R8.2 5.9,19.88 5.31,19.29 U5.3
GND  (via drill 0.35)
  Top 0.152: U2.2 33.52,12.04 U2.PAD | v19.03,22.31 27.59,22.31 28.89,23.62 31.28,23.62 32.31,22.59 | v22.38,19.66 23.48,20.76 30.98,20.76 31.02,20.8 | C22.2 11.93,19.74 12.4,19.26 14.17,19.26 v15.51,20.6 | C7.2 v1.67,20.19 v1.68,20.18 | C3.2 37.61,13.83 v36.98,14.46 | v25.12,33.22 29.52,33.22 | 32.31,22.59 32.31,22.09 31.02,20.8 | 32.31,22.59 32.31,23.26 32.45,23.4 | v31.02,20.14 31.02,20.8 | 9.43,6.46 9.5,6.39 9.5,6.34 9.43,6.41 9.43,6.46 | 9.43,6.46 9.43,6.73 | v9.69,7.3 C19.2 | v8.03,10.26 7.99,10.29 U4.2 | C1.2 4.6,18.26 3.89,18.97 U5.2 3.89,18.71 v3.13,17.95 | C8.2 31.91,37.88 v31.91,36.69 | S1.A 35.61,35.56 v34.87,36.31 | U1.42 29.74,36.21 v30.24,36.71 | v34.03,30.54 34.4,30.54 S1.B
  Top 0.203: J1.SH4 J1.SH2 J1.SH3 J1.SH1 18.16,4.25 J1.SH5
  Bottom 0.152: C16.2 18.33,22.31 v19.03,22.31 | C21.2 16.4,19.71 v15.51,20.6 | v36.98,14.46 38.46,15.94 v40.61,15.94 | LED3.3 24.9,33.22 v25.12,33.22 | C18.2 31.34,19.82 v31.02,20.14 | 32.03,30.32 31.44,30.32 LED4.3 33.35,31.23 v34.03,30.54 | C26.2 8.85,7.05 9.1,7.3 v9.69,7.3 | LED2.3 15.29,32.78 v15.73,33.22 | v3.13,17.95 1.68,19.4 v1.68,20.18 | C13.2 31.91,36.65 | 31.91,36.65 v31.91,36.69 32.29,37.07 34.11,37.07 v34.87,36.31 | v30.24,36.71 31.85,36.71 31.91,36.65 | R9.1 30.06,7.9 LED13.3
  other vias: 9.55,19.74 1.79,24.13 30.06,6.65
  pour Bottom: -3.7,47.29 47.03,47.29 47.03,-0.8 -3.7,-0.8
  pour Top: 21.76,46.5 46.95,46.5 46.95,-3.19 -3.09,-3.19 -3.09,45.91 -3.09,46.5 21.75,46.5
N$1
  Top 0.152: R1.2 33.85,6.65 34.09,6.89 34.09,9.17 U2.9
N$2  (via drill 0.35)
  Top 0.152: R4.2 11.62,12.31 v11.27,12.66
  Bottom 0.152: v11.27,12.66 8.34,12.66 7.37,13.64 6.77,13.64 6.53,13.87 D3.A
N$4
  Top 0.152: U2.8 33.52,7.6 33.1,7.18 31.71,7.18 31.19,6.65 R9.2 | R9.2 | R5.1 31.07,4.88 R9.2
N$7
  Top 0.152: C5.2 15.74,9.06 Y1.P$2 15.94,10.37 U1.18
N$8
  Top 0.152: U1.19 17.75,9.55 Y1.P$1 17.85,8.86 16.52,7.53 15.33,7.53 14.86,8.01 C4.2
N$9
  Top 0.152: R6.2 9.51,8.61 U4.5
N$10
  Top 0.152: Q2.5 9.81,31.83 9.65,31.83 9.52,31.96 9.52,33.41 8.71,34.21 6.26,34.21 5.8,33.75 5.8,32.26 5.84,32.22 R17.2
N$12
  Top 0.152: Q2.2 7.78,31.56 7.6,31.38 7.09,31.38 R18.2
N$14
  Top 0.152: GPIO18PU.2 22.33,8.44 R14.1
N$15  (via drill 0.35)
  Bottom 0.152: LED1.4 4.94,31.9 4.94,16.16 4.91,16.13 4.91,15.12 5.43,14.6 6.24,14.6 6.9,13.94 8.44,13.94 8.81,14.31 LED_IO.2
  other vias: 10.01,14.31
N$16
  Bottom 0.305: LED1.2 12.47,31.81 LED2.4
N$17  (via drill 0.35)
  Top 0.2: R3.2 13.17,4.76 D1.A
  other vias: 14.57,4.76
N$18
  Bottom 0.305: LED2.2 20.09,31.81 LED3.4
N$19
  Bottom 0.305: LED4.4 29.75,34.63 27.71,32.59 LED3.2
N$20
  Bottom 0.305: LED5.4 29.11,29.7 29.11,32 29.63,32.52 34.02,32.52 35.31,31.23 LED4.2
N$21
  Bottom 0.305: LED5.2 32.84,27.37 29.78,27.37 29.01,28.13 29.01,28.63 28.47,29.18 23.81,29.18 LED6.4
N$22
  Bottom 0.305: LED6.2 25.33,27.26 21.94,27.26 21.39,27.8 21.39,28.63 20.89,29.13 16.14,29.13 LED7.4
N$23
  Bottom 0.305: LED7.2 17.57,27.4 14.44,27.4 13.77,28.06 13.77,28.63 13.13,29.28 8.43,29.28 7.67,28.52 LED8.4
N$26
  Bottom 0.305: LED9.4 7.67,20.98 8.92,22.23 11.74,22.23 12.47,22.96 LED8.2
N$27
  Bottom 0.305: LED9.2 12.47,16.16 14.43,18.12 LED10.4
N$28
  Bottom 0.305: LED10.2 20.09,16.09 22.12,18.12 LED11.4
N$29
  Bottom 0.305: LED11.2 27.71,16.74 28.23,17.26 29.67,17.26 LED12.4
N$30
  Bottom 0.305: LED13.4 33.48,14.72 LED12.2
N$31
  Bottom 0.305: LED13.2 32.82,10.88 26.75,10.88 25.86,11.77 LED14.4
N$32
  Bottom 0.305: LED14.2 25.18,10.92 23.74,10.92 23.73,10.91 19.24,10.91 18.39,11.77 LED15.4
N$33
  Bottom 0.305: LED15.2 17.58,10.88 11.56,10.88 10.67,11.77 LED16.4
RTS
  Top 0.152: U2.19 35.52,26.13 33.23,28.42 31.57,28.42 30.74,29.25 30.74,29.46 30.57,29.63 12.02,29.63 10.74,30.91 Q2.4 8.51,29.34 R18.1
RX0
  Top 0.152: U2.21 34.52,26.27 33.35,27.44 U1.38
SCL  (via drill 0.35)
  Top 0.152: v31.7,22.34 30.66,22.34 30.58,22.26 28.79,22.26 27.82,21.29 16.45,21.29 14.39,23.35 14.39,26.32 14.09,26.62 14.07,26.62 U1.5
  Bottom 0.152: v31.7,22.34 35.07,22.34 39.07,26.34 SCL.1
SDA  (via drill 0.35)
  Top 0.152: U1.4 12.76,28.45 12.31,28.45 10.28,26.43 v10.16,26.43
  Bottom 0.152: SDA.1 36.71,20.77 18.95,20.77 18.51,21.21 15.07,21.21 13.85,22.43 13.85,25.31 12.73,26.43 v10.16,26.43
TX0
  Top 0.152: U2.20 35.02,26.2 33.1,28.12 28.89,28.12 28.46,27.68 28.46,26.17 28.69,25.94 U1.37
V_BATT  (via drill 0.35)
  Top 0.152: +.1 3.23,15.01 5.68,12.56 C6.1 5.99,11.21 U4.3
  Bottom 0.152: Q1.3 3.91,26.01
  Bottom 0.406: +.1 3.91,15.77 3.91,26.01
  other vias: 3.85,26.07
V_USB  (via drill 0.35)
  Top 0.152: 7.04,15.65 7.04,14.52 9.15,12.4 9.44,12.4 10.06,11.79 10.06,9.78 9.93,9.65 8.08,9.65 U4.4 7.86,7.79 C19.1 7.86,6.75 9.26,5.34 10.95,4.16 R3.1 | 7.04,15.65 7.04,22.13 6.74,22.43 v6.74,22.8 | R5.2 27.49,3.8 20.84,3.8 20.36,4.28 J1.1 | R7.2 3.02,26.96 | 3.02,26.96 3.02,24.09 Q1.1 | 3.02,26.96 4.22,26.96 v8,23.18 | 7.04,15.65 4.44,15.65 3.73,16.36 1.96,16.36 1.89,16.42
  Top 0.2: 16.87,6.45 D2.A 14.2,6.45 12.46,4.71 12.16,4.71 11.61,4.16 R3.1
  Top 0.203: 16.87,6.45 20.11,6.45 20.36,6.2 J1.1
  Bottom 0.152: v6.74,22.8 7.12,23.18 v8,23.18
VIN
  Top 0.152: 10.85,10.84 10.85,12.19 10.33,12.71 9.28,12.71 9.14,12.84 9.14,13 7.37,14.78 7.37,15.06 | 7.37,23.27 6.64,24 R8.1 4.83,24 Q1.2 4,23.17 | C7.1 4,23.17 | U5.1 2.94,19.81 3.78,20.65 3.78,22.87 3.78,22.95 4,23.17
  Top 0.2: D2.C 12.68,8.13 10.85,9.96 10.85,10.84 | 7.37,15.06 7.37,23.27

### Text on the board
tPlace: BAT
tNames: USB